# EAGLE design LEDcube (EAGLE 7.6.0)
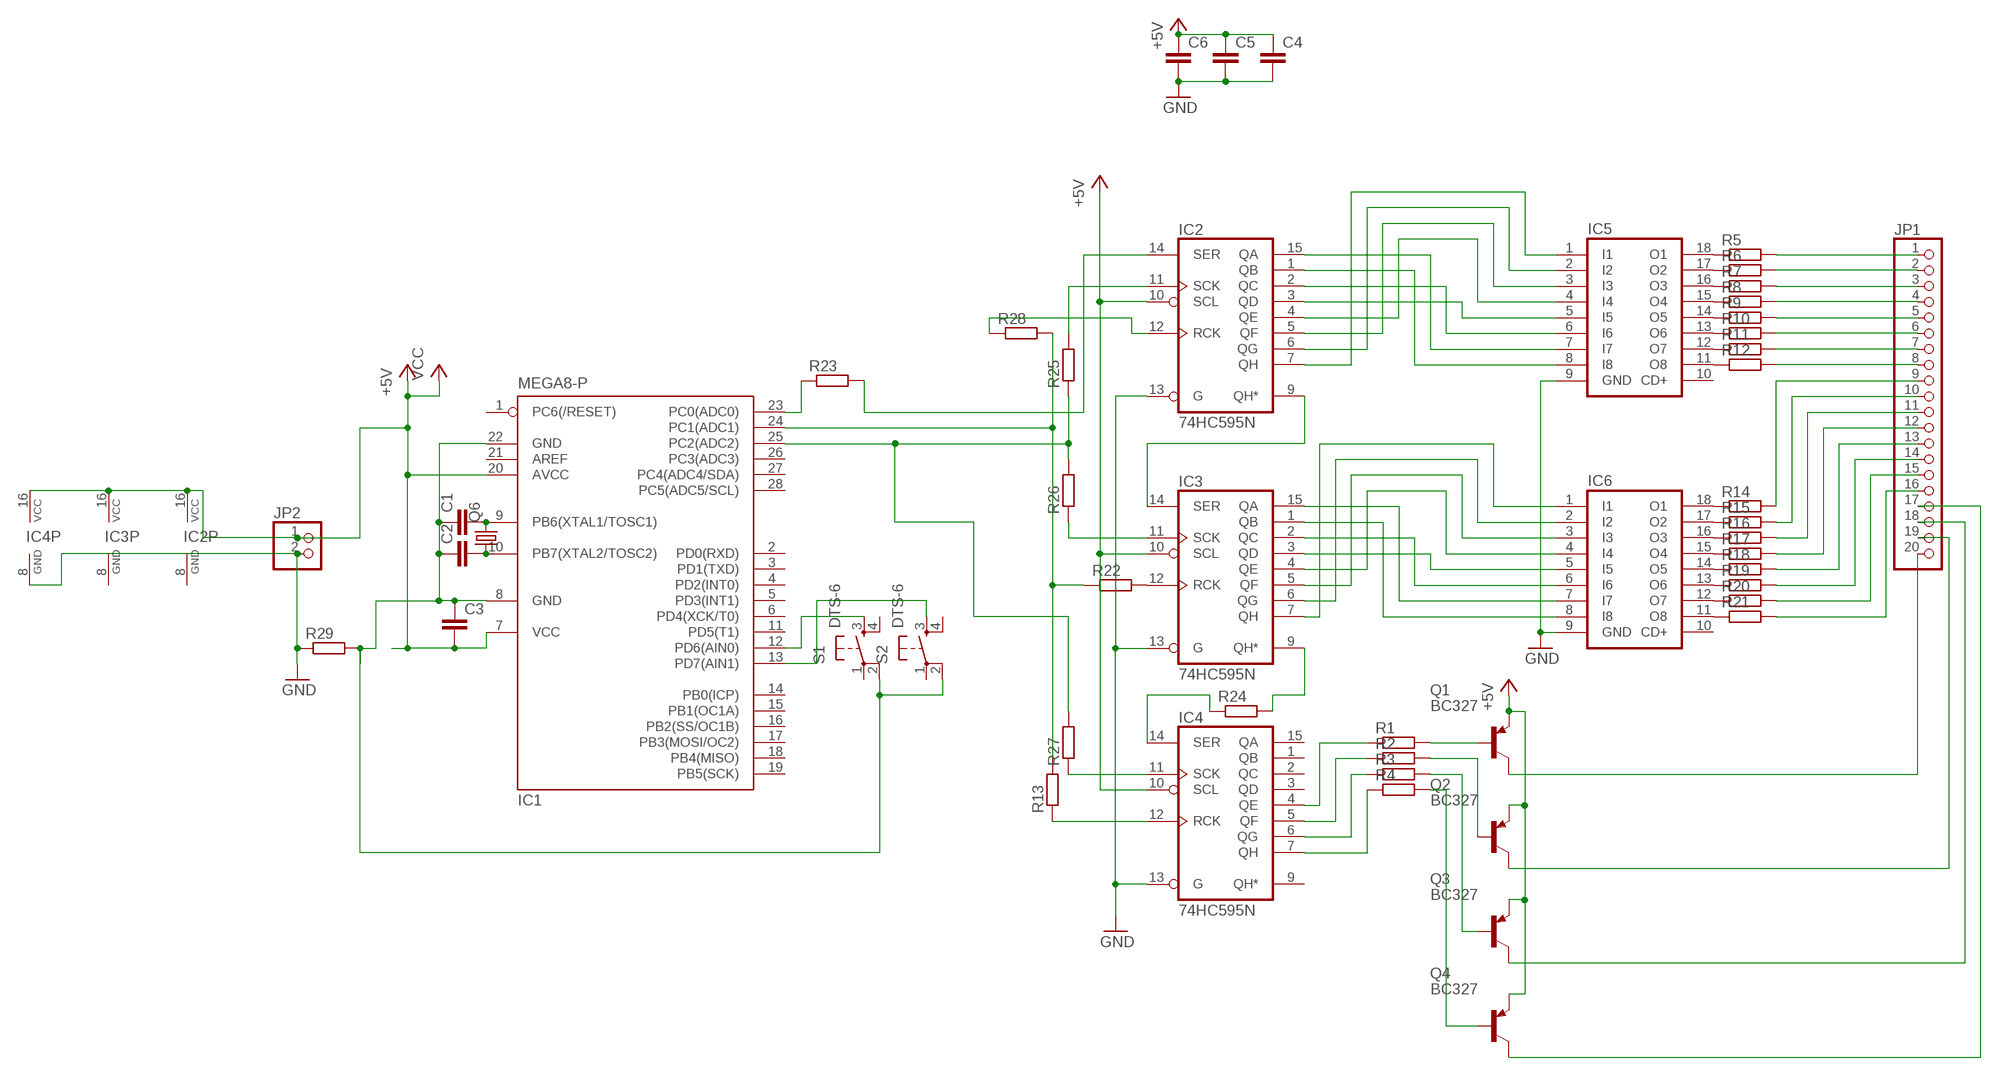
[diagram p0: schematic, sheet 1]

## Parts
C1  C-EU025-024X044  [C025-024X044]
C2  C-EU025-024X044  [C025-024X044]
C3  C-EU025-024X044  [C025-024X044]
C4  C-EU025-024X044  [C025-024X044]
C5  C-EU025-024X044  [C025-024X044]
C6  C-EU025-024X044  [C025-024X044]
IC1  MEGA8-P  [DIL28-3]
IC2  74HC595N  [DIL16]
IC3  74HC595N  [DIL16]
IC4  74HC595N  [DIL16]
IC5  ULN2803A  [DIL18]
IC6  ULN2803A  [DIL18]
JP1  PINHD-1X20  [1X20]
JP2  PINHD-1X2  [1X02]
Q1  BC327  [TO92-EBC]
Q2  BC327  [TO92-EBC]
Q3  BC327  [TO92-EBC]
Q4  BC327  [TO92-EBC]
Q6  CRYSTALHC18U-V  [HC18U-V]
R1  R-EU_0204/5  [0204/5]
R2  R-EU_0204/5  [0204/5]
R3  R-EU_0204/5  [0204/5]
R4  R-EU_0204/5  [0204/5]
R5  R-EU_0204/2V  [0204V]
R6  R-EU_0204/2V  [0204V]
R7  R-EU_0204/2V  [0204V]
R8  R-EU_0204/2V  [0204V]
R9  R-EU_0204/2V  [0204V]
R10  R-EU_0204/2V  [0204V]
R11  R-EU_0204/2V  [0204V]
R12  R-EU_0204/2V  [0204V]
R13  R-EU_0204/2V  [0204V]
R14  R-EU_0204/2V  [0204V]
R15  R-EU_0204/2V  [0204V]
R16  R-EU_0204/2V  [0204V]
R17  R-EU_0204/2V  [0204V]
R18  R-EU_0204/2V  [0204V]
R19  R-EU_0204/2V  [0204V]
R20  R-EU_0204/2V  [0204V]
R21  R-EU_0204/2V  [0204V]
R22  R-EU_0204/7  [0204/7]
R23  R-EU_0204/7  [0204/7]
R24  R-EU_0204/2V  [0204V]
R25  R-EU_0204/2V  [0204V]
R26  R-EU_0204/5  [0204/5]
R27  R-EU_0204/2V  [0204V]
R28  R-EU_0204/5  [0204/5]
R29  R-EU_0204/5  [0204/5]
S1  DTS-6  [DTS-6]
S2  DTS-6  [DTS-6]

## Nets
+5V: C3.2 C4.1 C5.1 C6.1 IC1.7(VCC) IC1.20(AVCC) IC2.10(SCL) IC2.16(VCC) IC3.10(SCL) IC3.16(VCC) IC4.10(SCL) IC4.16(VCC) JP2.1 Q1.E Q2.E Q3.E Q4.E ; supply symbol labelled VCC
GND: C4.2 C5.2 C6.2 IC2.13(G) IC3.13(G) IC4.8(GND) IC4.13(G) IC5.9(GND) IC6.9(GND) JP2.2 R29.1
GND2: C1.1 C2.1 C3.1 IC1.8(GND) IC1.22(GND) R29.2 S1.2 S2.2
N$1: C1.2 IC1.9(PB6(XTAL1/TOSC1)) Q6.2
N$2: C2.2 IC1.10(PB7(XTAL2/TOSC2)) Q6.1
N$3: IC4.7(QH) R4.1
N$4: IC4.6(QG) R3.1
N$5: IC4.5(QF) R2.1
N$6: IC2.14(SER) R23.2
N$7: IC2.9(QH*) IC3.14(SER)
N$8: IC4.14(SER) R24.1
N$9: IC1.12(PD6(AIN0)) S1.3
N$10: IC1.24(PC1(ADC1)) R13.2 R22.1 R28.2
N$11: IC3.9(QH*) R24.2
N$12: IC2.1(QB) IC5.8(I8)
N$13: IC2.15(QA) IC5.7(I7)
N$14: IC2.2(QC) IC5.6(I6)
N$15: IC2.3(QD) IC5.5(I5)
N$16: IC2.4(QE) IC5.4(I4)
N$17: IC2.5(QF) IC5.3(I3)
N$18: IC2.6(QG) IC5.2(I2)
N$19: IC2.7(QH) IC5.1(I1)
N$20: IC3.1(QB) IC6.8(I8)
N$21: IC3.15(QA) IC6.7(I7)
N$22: IC3.2(QC) IC6.6(I6)
N$23: IC3.3(QD) IC6.5(I5)
N$24: IC3.4(QE) IC6.4(I4)
N$25: IC3.5(QF) IC6.3(I3)
N$26: IC3.6(QG) IC6.2(I2)
N$27: IC4.4(QE) R1.1
N$28: Q1.B R1.2
N$29: Q2.B R2.2
N$30: Q3.B R3.2
N$31: Q4.B R4.2
N$32: IC5.18(O1) R5.1
N$33: IC5.17(O2) R6.1
N$34: IC5.16(O3) R7.1
N$35: IC5.15(O4) R8.1
N$36: IC5.14(O5) R9.1
N$37: IC5.13(O6) R10.1
N$38: IC5.12(O7) R11.1
N$39: IC5.11(O8) R12.1
N$40: JP1.1 R5.2
N$41: IC6.18(O1) R14.1
N$42: IC6.17(O2) R15.1
N$43: IC6.16(O3) R16.1
N$44: IC6.15(O4) R17.1
N$45: IC6.14(O5) R18.1
N$46: IC6.13(O6) R19.1
N$47: IC6.12(O7) R20.1
N$48: IC6.11(O8) R21.1
N$49: JP1.2 R6.2
N$50: JP1.3 R7.2
N$51: JP1.4 R8.2
N$52: JP1.5 R9.2
N$53: JP1.6 R10.2
N$54: JP1.7 R11.2
N$55: JP1.8 R12.2
N$56: JP1.9 R14.2
N$57: JP1.10 R15.2
N$58: JP1.11 R16.2
N$59: JP1.12 R17.2
N$60: JP1.13 R18.2
N$61: JP1.14 R19.2
N$62: JP1.15 R20.2
N$63: JP1.16 R21.2
N$64: JP1.20 Q1.C
N$65: JP1.19 Q2.C
N$66: JP1.18 Q3.C
N$67: JP1.17 Q4.C
N$69: IC3.7(QH) IC6.1(I1)
N$70: IC1.25(PC2(ADC2)) R25.1 R26.2 R27.2
N$71: IC1.13(PD7(AIN1)) S2.3
N$72: IC1.23(PC0(ADC0)) R23.1
N$73: IC4.11(SCK) R27.1
N$74: IC3.12(RCK) R22.2
N$75: IC2.12(RCK) R28.1
N$76: IC4.12(RCK) R13.1
N$78: IC3.11(SCK) R26.1
N$79: IC2.11(SCK) R25.2
Unconnected: IC1.1(PC6(/RESET)) IC1.2(PD0(RXD)) IC1.3(PD1(TXD)) IC1.4(PD2(INT0)) IC1.5(PD3(INT1)) IC1.6(PD4(XCK/T0)) IC1.11(PD5(T1)) IC1.14(PB0(ICP)) IC1.15(PB1(OC1A)) IC1.16(PB2(SS/OC1B)) IC1.17(PB3(MOSI/OC2)) IC1.18(PB4(MISO)) IC1.19(PB5(SCK)) IC1.21(AREF) IC1.26(PC3(ADC3)) IC1.27(PC4(ADC4/SDA)) IC1.28(PC5(ADC5/SCL)) IC4.1(QB) IC4.2(QC) IC4.3(QD) IC4.9(QH*) IC4.15(QA) IC5.10(CD+) IC6.10(CD+) S1.1 S1.4 S2.1 S2.4

## Power pins joined to a net without a drawn wire
GND: IC2.8(GND) IC3.8(GND)

## Library data of the parts
C1-C6 = rcl:C-EU: CAPACITOR, European symbol
IC1 = atmel:MEGA8-P: MICROCONTROLLER 8 Kbytes FLASH, 1 kbytes SRAM, 512 bytes EEPROM, USART, 4-channel 10 bit ADC, 2-channel 8 bit ADC Pin compatible with Atmega48, ATMega88, ATMega168 Source: avr.lbr; OC_FARNELL: unknown; OC_NEWARK: unknown
IC2-IC4 = 74xx-eu:74*595: 8-bit SHIFT REGISTER, output latch
IC5 IC6 = uln-udn:ULN2803A: DRIVER ARRAY
JP1 = pinhead:PINHD-1X20: PIN HEADER
JP2 = pinhead:PINHD-1X2: PIN HEADER
Q1-Q4 = transistor-pnp:BC327*: PNP Transistror
Q6 = crystal:CRYSTAL: CRYSTAL; OC_FARNELL: unknown; OC_NEWARK: unknown
R1-R29 = rcl:R-EU_: RESISTOR, European symbol
S1 S2 = switch-tact:DTS-6

## Board
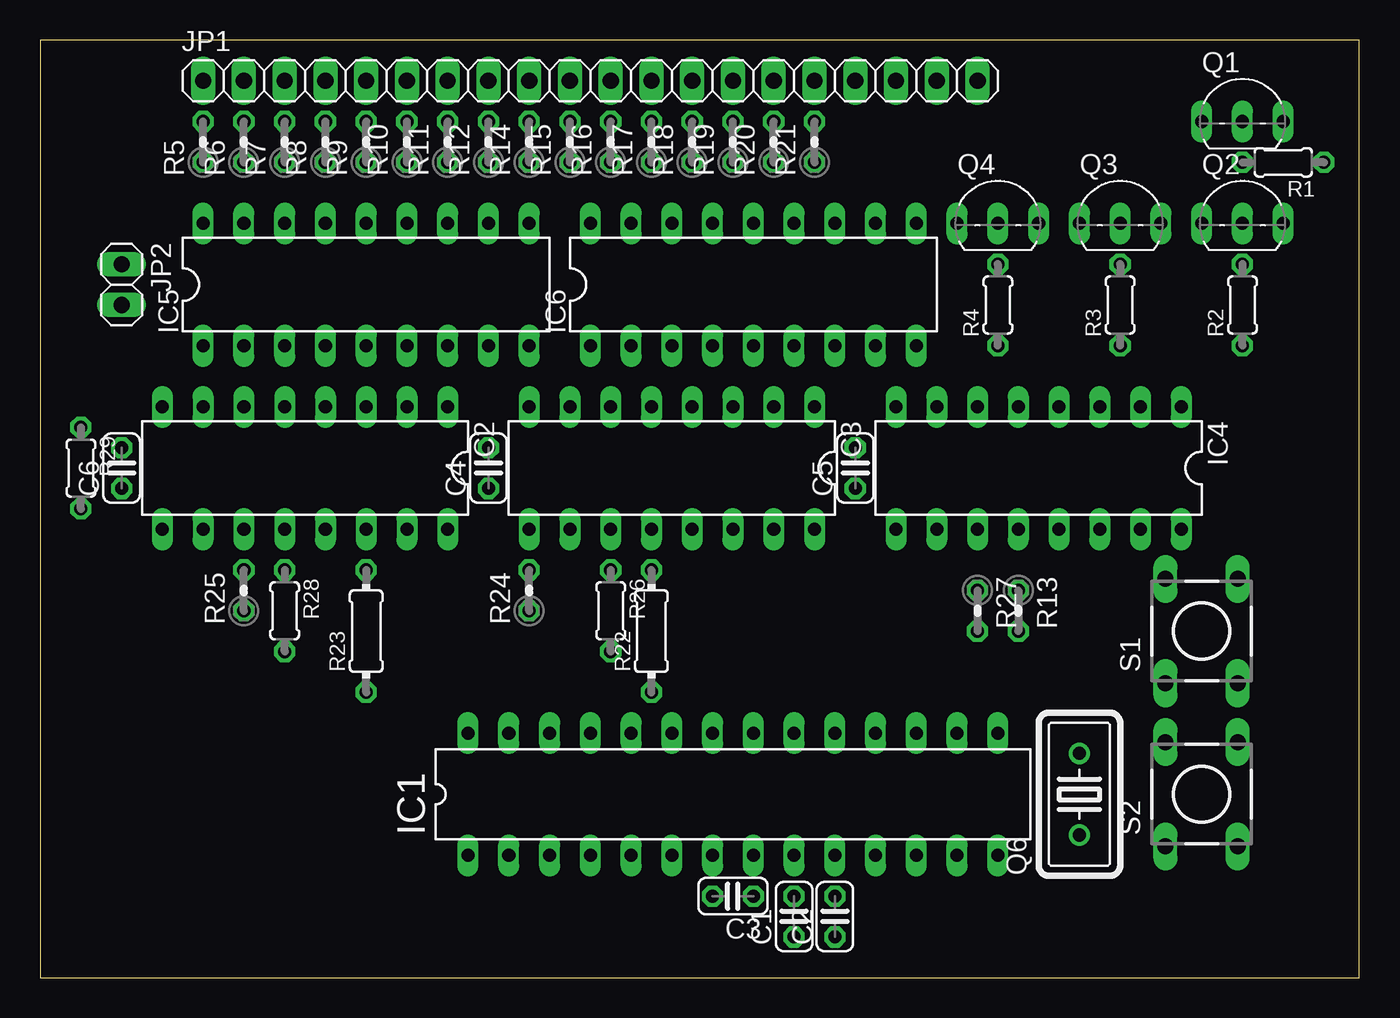
[diagram p1: board, top side]
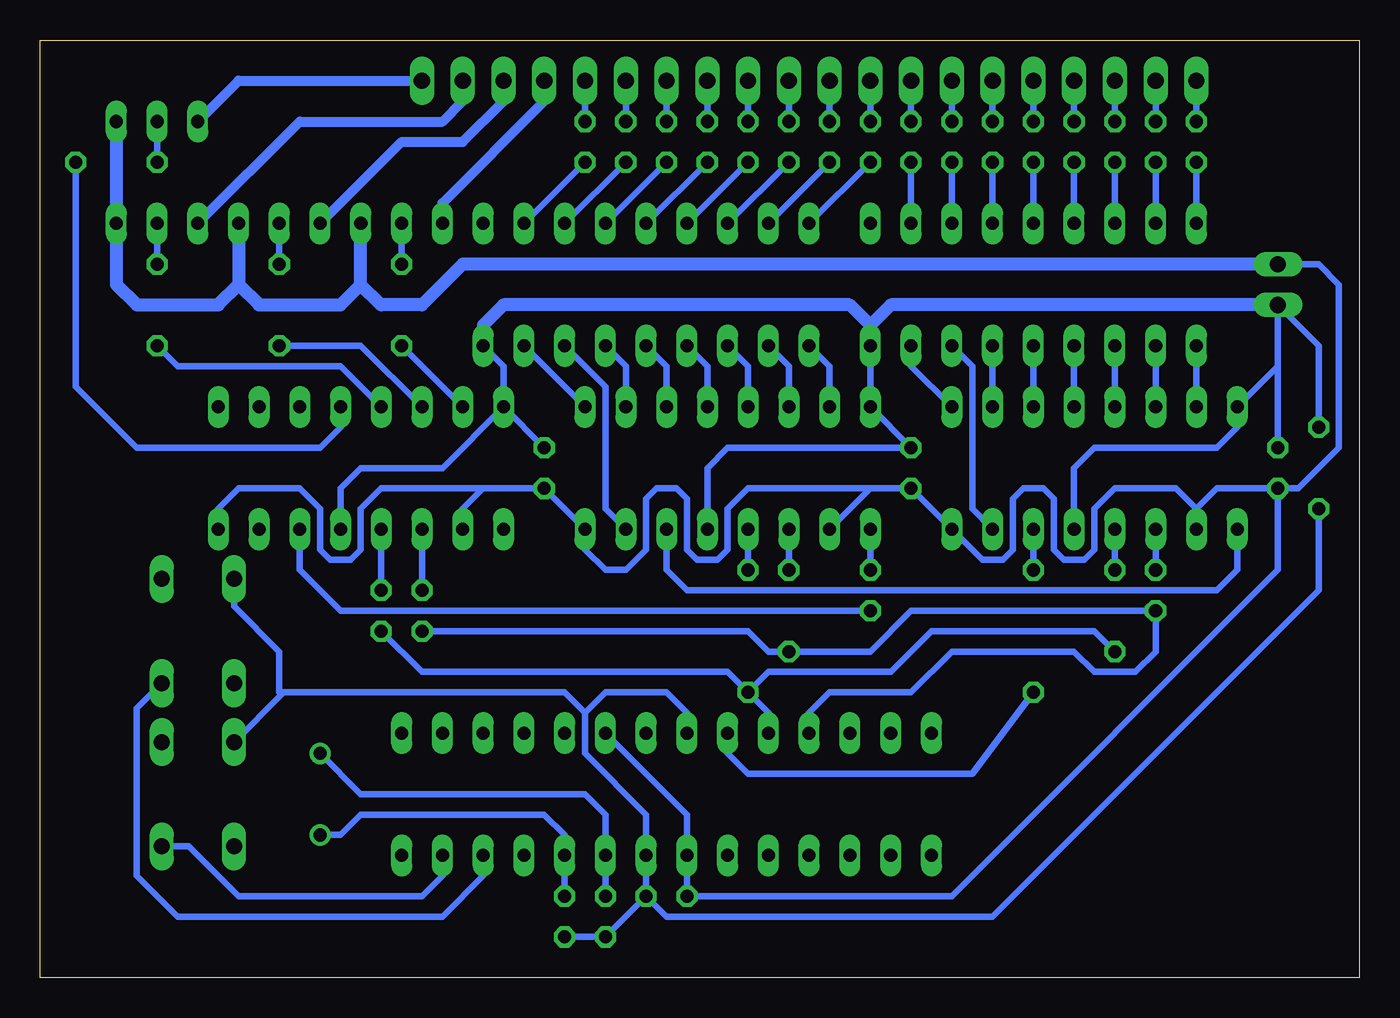
[diagram p2: board, bottom side, seen from below]

Size 82.22 x 58.41 mm. Coordinates in mm from the lower left corner, seen from the top.
Outline: 0,0 82.22,0 82.22,58.41 0,58.41 0,0
Copper layers (1*16): Top 0.035mm / dielectric 1.5mm / Bottom 0.035mm
Design rules "default": minimum track width 10mil, minimum drill 24mil, track to track 8mil, track to pad 8mil, pad to pad 8mil, via to via 8mil, smd to smd 8mil, copper to edge 40mil, drill to drill 8mil, minimum pad ring 10mil, minimum via ring 8mil, stop-mask expansion 4mil, vias tented up to drill 0mil, thermal gap 10mil

### Footprints (pad centres in the part's own frame; a part is rotated, then mirrored left to right if it is on the bottom)
C025-024X044 = drill 0.813 octagon: 1 -1.27,0; 2 1.27,0
DIL28-3 = drill 0.813 long: 1 -16.51,-3.81; 2 -13.97,-3.81; 3 -11.43,-3.81; 4 -8.89,-3.81; 5 -6.35,-3.81; 6 -3.81,-3.81; 7 -1.27,-3.81; 8 1.27,-3.81; 9 3.81,-3.81; 10 6.35,-3.81; 11 8.89,-3.81; 12 11.43,-3.81; 13 13.97,-3.81; 14 16.51,-3.81; 15 16.51,3.81; 16 13.97,3.81; 17 11.43,3.81; 18 8.89,3.81; 19 6.35,3.81; 20 3.81,3.81; 21 1.27,3.81; 22 -1.27,3.81; 23 -3.81,3.81; 24 -6.35,3.81; 25 -8.89,3.81; 26 -11.43,3.81; 27 -13.97,3.81; 28 -16.51,3.81
DIL16 = drill 0.813 long: 1 -8.89,-3.81; 2 -6.35,-3.81; 3 -3.81,-3.81; 4 -1.27,-3.81; 5 1.27,-3.81; 6 3.81,-3.81; 7 6.35,-3.81; 8 8.89,-3.81; 9 8.89,3.81; 10 6.35,3.81; 11 3.81,3.81; 12 1.27,3.81; 13 -1.27,3.81; 14 -3.81,3.81; 15 -6.35,3.81; 16 -8.89,3.81
DIL18 = drill 0.813 long: 1 -10.16,-3.81; 2 -7.62,-3.81; 3 -5.08,-3.81; 4 -2.54,-3.81; 5 0,-3.81; 6 2.54,-3.81; 7 5.08,-3.81; 8 7.62,-3.81; 9 10.16,-3.81; 10 10.16,3.81; 11 7.62,3.81; 12 5.08,3.81; 13 2.54,3.81; 14 0,3.81; 15 -2.54,3.81; 16 -5.08,3.81; 17 -7.62,3.81; 18 -10.16,3.81
1X20 = drill 1.016 long: 1 -24.13,0; 2 -21.59,0; 3 -19.05,0; 4 -16.51,0; 5 -13.97,0; 6 -11.43,0; 7 -8.89,0; 8 -6.35,0; 9 -3.81,0; 10 -1.27,0; 11 1.27,0; 12 3.81,0; 13 6.35,0; 14 8.89,0; 15 11.43,0; 16 13.97,0; 17 16.51,0; 18 19.05,0; 19 21.59,0; 20 24.13,0
1X02 = drill 1.016 long: 1 -1.27,0; 2 1.27,0
TO92-EBC = drill 0.813 long: B 0,-1.27; C -2.54,-1.27; E 2.54,-1.27
HC18U-V = drill 0.813: 1 -2.54,0; 2 2.54,0
0204/5 = drill 0.813 octagon: 1 -2.54,0; 2 2.54,0
0204V = drill 0.813 octagon: 1 -1.27,0; 2 1.27,0
0204/7 = drill 0.813 octagon: 1 -3.81,0; 2 3.81,0
DTS-6 = drill 1 long: 1 -3.25,2.25; 2 3.25,2.25; 3 -3.25,-2.25; 4 3.25,-2.25

### Placement (x,y rotation side)
C1  46.99,3.81 90 top
C2  49.53,3.81 90 top
C3  43.18,5.08 180 top
C4  27.94,31.75 90 top
C5  50.8,31.75 90 top
C6  5.08,31.75 90 top
IC1  43.18,11.43 0 top
IC2  16.51,31.75 180 top
IC3  39.37,31.75 180 top
IC4  62.23,31.75 180 top
IC5  20.32,43.18 0 top
IC6  44.45,43.18 0 top
JP1  34.29,55.88 0 top
JP2  5.08,43.18 270 top
Q1  74.93,54.61 0 top
Q2  74.93,48.26 0 top
Q3  67.31,48.26 0 top
Q4  59.69,48.26 0 top
Q6  64.77,11.43 90 top
R1  77.47,50.8 180 top
R2  74.93,41.91 90 top
R3  67.31,41.91 90 top
R4  59.69,41.91 90 top
R5  10.16,52.07 90 top
R6  12.7,52.07 90 top
R7  15.24,52.07 90 top
R8  17.78,52.07 90 top
R9  20.32,52.07 90 top
R10  22.86,52.07 90 top
R11  25.4,52.07 90 top
R12  27.94,52.07 90 top
R13  60.96,22.86 270 top
R14  30.48,52.07 90 top
R15  33.02,52.07 90 top
R16  35.56,52.07 90 top
R17  38.1,52.07 90 top
R18  40.64,52.07 90 top
R19  43.18,52.07 90 top
R20  45.72,52.07 90 top
R21  48.26,52.07 90 top
R22  38.1,21.59 90 top
R23  20.32,21.59 90 top
R24  30.48,24.13 90 top
R25  12.7,24.13 90 top
R26  35.56,22.86 270 top
R27  58.42,22.86 270 top
R28  15.24,22.86 270 top
R29  2.54,31.75 270 top
S1  72.39,21.59 90 top
S2  72.39,11.43 90 top

### Tracks (layer width: path | path; a pad name or v marks a point on that pad's centre or on a via)
+5V
  Bottom 0.406: 30.48,30.48 C4.1 IC2.16 23.49,26.04 22.22,26.04 21.59,26.67 21.59,29.84 20.95,30.48 19.68,30.48 19.05,29.84 19.05,26.67 18.41,26.04 17.14,26.04 16.51,26.67 16.51,29.21 15.24,30.48 11.43,30.48 10.16,29.21 | 30.48,30.48 IC3.10 | 54.61,30.48 C5.1 IC3.16 48.26,26.67 46.99,25.4 45.72,25.4 44.45,26.67 44.45,29.84 43.81,30.48 42.55,30.48 41.91,29.84 41.91,26.67 41.27,26.04 40.01,26.04 39.37,26.67 39.37,29.21 38.1,30.48 30.48,30.48 | 54.61,30.48 55.88,29.21 IC4.10 | IC4.16 71.12,29.21 69.85,30.48 66.04,30.48 64.77,29.21 64.77,26.67 64.14,26.04 62.86,26.04 62.23,26.67 62.23,29.21 60.96,30.48 54.61,30.48 | JP2.1 2.54,44.45 1.27,43.18 1.27,33.02 3.81,30.48 C6.1 | IC1.20 41.91,10.16 IC1.7 C3.2 25.4,5.08 5.08,25.4 C6.1 | IC2.10 10.16,29.21 | 10.16,29.21 8.89,30.48 C6.1
  Bottom 0.813: 69.85,43.18 71.12,41.91 76.2,41.91 77.47,43.18 Q2.E Q1.E | Q3.E 69.85,43.18 | 69.85,43.18 68.58,41.91 63.5,41.91 62.23,43.18 | 62.23,43.18 Q4.E | JP2.1 55.88,44.45 58.42,41.91 60.96,41.91 62.23,43.18
GND
  Bottom 0.406: IC2.13 17.78,31.75 16.51,33.02 8.89,33.02 7.62,34.29 IC2.8 5.08,38.1 | IC3.13 40.64,31.75 39.37,33.02 C4.2 IC3.8 IC5.9 | IC6.9 53.34,38.1 IC4.8 | IC4.8 C5.2 | 5.08,38.1 JP2.2 2.54,39.37 R29.1 | IC4.8 57.15,31.75 62.23,31.75 63.5,30.48 IC4.13 | C6.2 5.08,38.1
  Bottom 0.813: 30.48,40.64 31.75,41.91 53.34,41.91 54.61,40.64 IC6.9 | IC5.9 30.48,40.64 | 30.48,40.64 29.21,41.91 JP2.2
GND2
  Bottom 0.406: C2.1 C1.1 C3.1 | C3.1 IC1.8 44.45,10.16 48.26,13.97 48.26,16.51 | 48.26,16.51 46.99,17.78 43.18,17.78 41.91,16.51 IC1.22 | R29.2 2.54,24.13 22.86,3.81 43.18,3.81 C3.1 | 48.26,16.51 49.53,17.78 67.04,17.78 67.17,17.64 | 67.17,17.64 S2.2 | S1.2 70.14,23.15 67.31,20.32 67.31,17.78 67.17,17.64
N$1
  Bottom 0.406: C1.2 IC1.9 46.99,10.16 48.26,11.43 62.23,11.43 Q6.2
N$2
  Bottom 0.406: C2.2 IC1.10 49.53,8.89 50.8,10.16 62.23,10.16 63.5,8.89 Q6.1
N$3
  Bottom 0.406: R4.1 IC4.7
N$4
  Bottom 0.406: R3.1 62.23,39.37 IC4.6
N$5
  Bottom 0.406: IC4.5 63.5,38.1 73.66,38.1 R2.1
N$6
  Bottom 0.406: R23.2 IC2.14
N$7
  Bottom 0.406: IC2.9 7.62,25.4 8.89,24.13 41.91,24.13 43.18,25.4 IC3.14
N$8
  Bottom 0.406: R24.1 63.5,22.86 66.04,25.4 IC4.14
N$9
  Bottom 0.406: IC1.12 54.61,6.35 57.15,3.81 73.66,3.81 76.2,6.35 76.2,16.78 S1.3
N$10
  Bottom 0.406: IC1.24 36.83,16.51 R22.1 | R22.1 36.83,19.05 29.21,19.05 26.67,21.59 16.51,21.59 R28.2 | R22.1 39.37,19.05 58.42,19.05 R13.2
N$11
  Bottom 0.406: R24.2 IC3.9
N$12
  Bottom 0.406: IC2.1 27.94,38.1 IC5.8
N$13
  Bottom 0.406: IC2.15 24.13,29.21 24.13,38.1 IC5.7
N$14
  Bottom 0.406: IC5.6 IC2.2
N$15
  Bottom 0.406: IC5.5 IC2.3
N$16
  Bottom 0.406: IC5.4 IC2.4
N$17
  Bottom 0.406: IC5.3 IC2.5
N$18
  Bottom 0.406: IC5.2 IC2.6
N$19
  Bottom 0.406: IC5.1 IC2.7
N$20
  Bottom 0.406: IC6.8 IC3.1
N$21
  Bottom 0.406: IC3.15 46.99,29.21 46.99,36.83 IC6.7
N$22
  Bottom 0.406: IC6.6 45.72,38.1 IC3.2
N$23
  Bottom 0.406: IC6.5 43.18,38.1 IC3.3
N$24
  Bottom 0.406: IC6.4 40.64,38.1 IC3.4
N$25
  Bottom 0.406: IC6.3 38.1,38.1 IC3.5
N$26
  Bottom 0.406: IC6.2 35.56,38.1 IC3.6
N$27
  Bottom 0.406: IC4.4 63.5,34.29 64.77,33.02 76.2,33.02 80.01,36.83 R1.1
N$28
  Bottom 0.406: Q1.B R1.2
N$29
  Bottom 0.406: Q2.B R2.2
N$30
  Bottom 0.406: Q3.B R3.2
N$31
  Bottom 0.406: Q4.B R4.2
N$32
  Bottom 0.406: R5.1 IC5.18
N$33
  Bottom 0.406: R6.1 IC5.17
N$34
  Bottom 0.406: R7.1 IC5.16
N$35
  Bottom 0.406: R8.1 IC5.15
N$36
  Bottom 0.406: R9.1 IC5.14
N$37
  Bottom 0.406: R10.1 IC5.13
N$38
  Bottom 0.406: R11.1 IC5.12
N$39
  Bottom 0.406: R12.1 IC5.11
N$40
  Bottom 0.406: JP1.1 R5.2
N$41
  Bottom 0.406: R14.1 IC6.18
N$42
  Bottom 0.406: R15.1 IC6.17
N$43
  Bottom 0.406: R16.1 IC6.16
N$44
  Bottom 0.406: R17.1 IC6.15
N$45
  Bottom 0.406: R18.1 IC6.14
N$46
  Bottom 0.406: R19.1 IC6.13
N$47
  Bottom 0.406: R20.1 IC6.12
N$48
  Bottom 0.406: IC6.11 R21.1
N$49
  Bottom 0.406: JP1.2 R6.2
N$50
  Bottom 0.406: JP1.3 R7.2
N$51
  Bottom 0.406: JP1.4 R8.2
N$52
  Bottom 0.406: JP1.5 R9.2
N$53
  Bottom 0.406: JP1.6 R10.2
N$54
  Bottom 0.406: JP1.7 R11.2
N$55
  Bottom 0.406: JP1.8 R12.2
N$56
  Bottom 0.406: JP1.9 R14.2
N$57
  Bottom 0.406: JP1.10 R15.2
N$58
  Bottom 0.406: JP1.11 R16.2
N$59
  Bottom 0.406: JP1.12 R17.2
N$60
  Bottom 0.406: JP1.13 R18.2
N$61
  Bottom 0.406: JP1.14 R19.2
N$62
  Bottom 0.406: JP1.15 R20.2
N$63
  Bottom 0.406: JP1.16 R21.2
N$64
  Bottom 0.61: Q1.C 69.85,55.88 JP1.20
N$65
  Bottom 0.61: Q2.C 66.04,53.34 57.15,53.34 55.88,54.61 JP1.19
N$66
  Bottom 0.61: Q3.C 59.69,52.07 55.88,52.07 53.34,54.61 JP1.18
N$67
  Bottom 0.61: Q4.C 57.15,48.26 50.8,54.61 JP1.17
N$69
  Bottom 0.406: IC6.1 33.02,38.1 IC3.7
N$70
  Bottom 0.406: IC1.25 34.29,16.51 33.02,17.78 27.94,17.78 25.4,20.32 17.78,20.32 16.51,19.05 13.97,19.05 12.7,20.32 R25.1 27.94,22.86 30.48,20.32 R26.2 36.83,20.32 38.1,21.59 R27.2
N$71
  Bottom 0.406: S2.3 72.95,8.18 69.85,5.08 58.42,5.08 57.15,6.35 IC1.13
N$72
  Bottom 0.406: IC1.23 39.37,13.97 38.1,12.7 24.13,12.7 R23.1
N$73
  Bottom 0.406: IC4.11 R27.1
N$74
  Bottom 0.406: IC3.12 R22.2
N$75
  Bottom 0.406: IC2.12 R28.1
N$76
  Bottom 0.406: IC4.12 R13.1
N$78
  Bottom 0.406: IC3.11 R26.1
N$79
  Bottom 0.406: IC2.11 R25.2